# Altium project Board_C24.PrjPcb
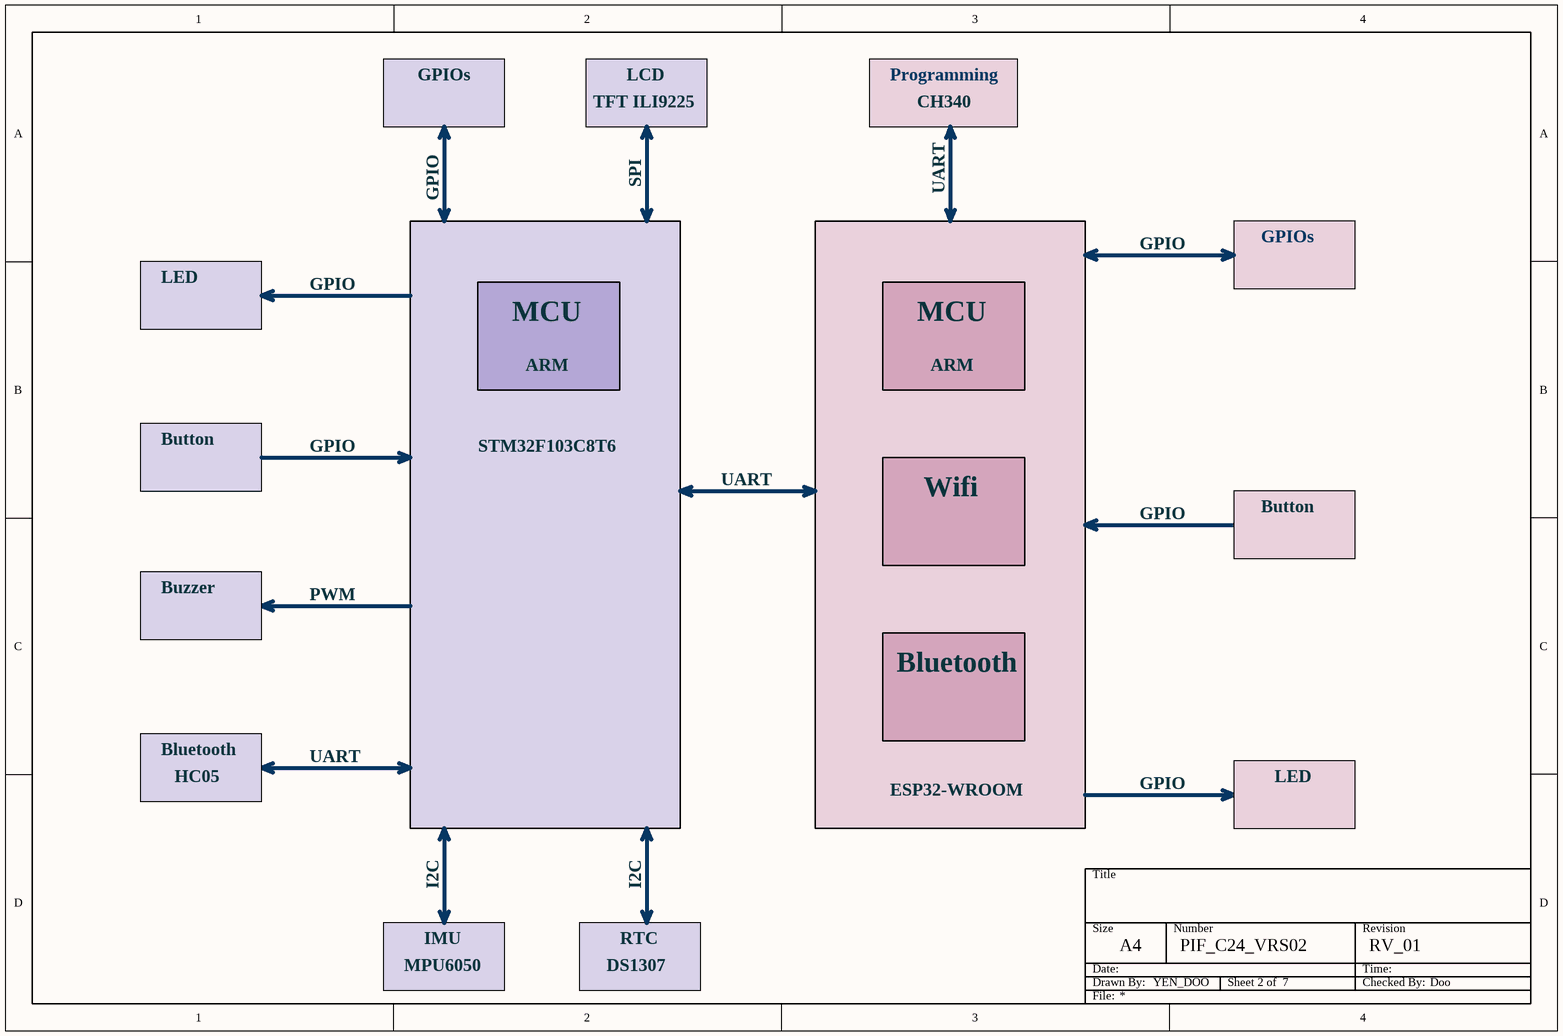
[diagram p0: 01_Block_Diagram.SchDoc]
5 sheets, 74 parts. Net scope: flat (ports and power ports of the same name join across sheets).
Board files: Board_C24_vrs0.PcbDoc, Board_C24_vrs02.PcbDoc, Board_C24_vrs03.PcbDoc, Board_C24_vrs01.PcbDoc
Sheets:
  01_Block_Diagram.SchDoc
  02_Power_Diagram.SchDoc
  03_MCU.SchDoc
  05_ESP32.SchDoc
  06_Power_Supply.SchDoc

## Sheet 01_Block_Diagram.SchDoc
size A4; CheckedBy: Doo; Author: Doo; DocumentNumber: PIF_C24_VRS02; Revision: RV_01; SheetNumber: 2; SheetTotal: 7

### Notes on the sheet
- GPIOs
- TFT ILI9225
- LCD
- Programming
- CH340
- GPIO
- SPI
- UART
- LED
- MCU
- ARM
- Button
- STM32F103C8T6
- Wifi
- Buzzer
- PWM
- Bluetooth
- HC05
- ESP32-WROOM
- I2C
- MPU6050
- IMU
- DS1307
- RTC
- Title
- Size
- Date:
- Drawn By:
- A4
- YEN_DOO
- Number
- Revision
- Checked By:
- Time:
- File:

## Sheet 02_Power_Diagram.SchDoc
size A4; CheckedBy: Doo; Author: Doo; DrawnBy: Doo; DocumentNumber: PIF_C24_VRS02; Revision: RV_01; SheetNumber: 3; SheetTotal: 7
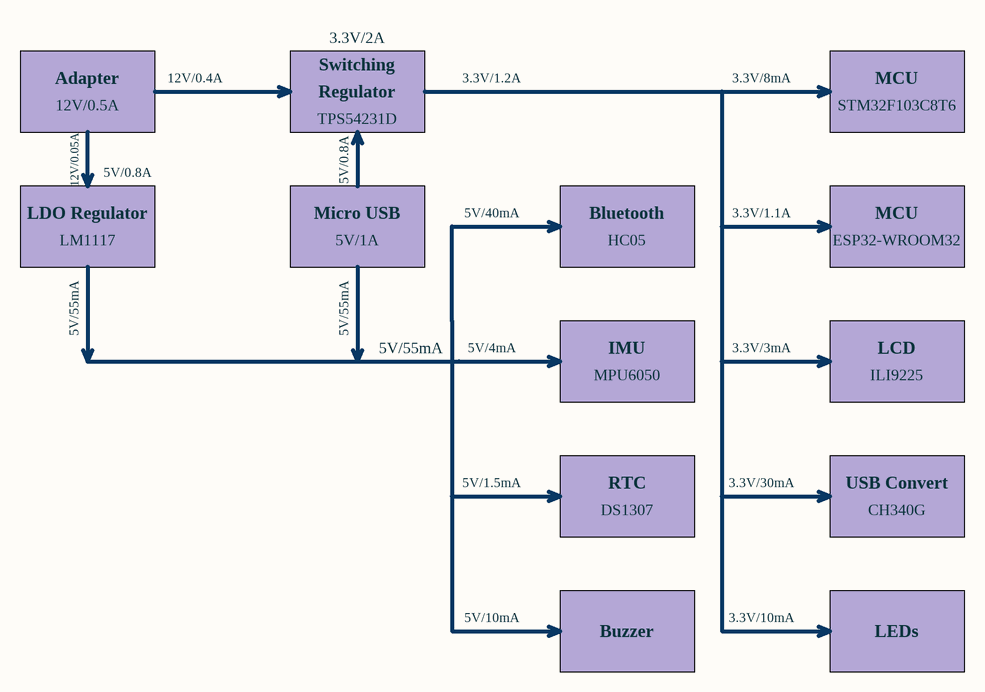
[diagram p1: 02_Power_Diagram.SchDoc]

### Notes on the sheet
- Adapter
- 12V/0.4A
- Switching
- Regulator
- 3.3V/2A
- 3.3V/1.2A
- 3.3V/8mA
- MCU
- 12V/0.05A
- 12V/0.5A
- 5V/0.8A
- TPS54231D
- STM32F103C8T6
- LDO Regulator
- Micro USB
- 5V/40mA
- Bluetooth
- 3.3V/1.1A
- LM1117
- 5V/1A
- HC05
- ESP32-WROOM32
- 5V/55mA
- 5V/4mA
- IMU
- 3.3V/3mA
- LCD
- MPU6050
- ILI9225
- 5V/1.5mA
- RTC
- 3.3V/30mA
- USB Convert
- DS1307
- CH340G
- 5V/10mA
- Buzzer
- 3.3V/10mA
- LEDs
- Title
- Size
- Date:
- Drawn By:
- A4
- YEN_DOO
- Number
- Revision
- Checked By:
- Time:
- File:

## Sheet 03_MCU.SchDoc
size A4; ApprovedBy: Doo; CheckedBy: Doo; DocumentNumber: PIF_C24_VRS02; Revision: RV_01; SheetNumber: 3; SheetTotal: 5
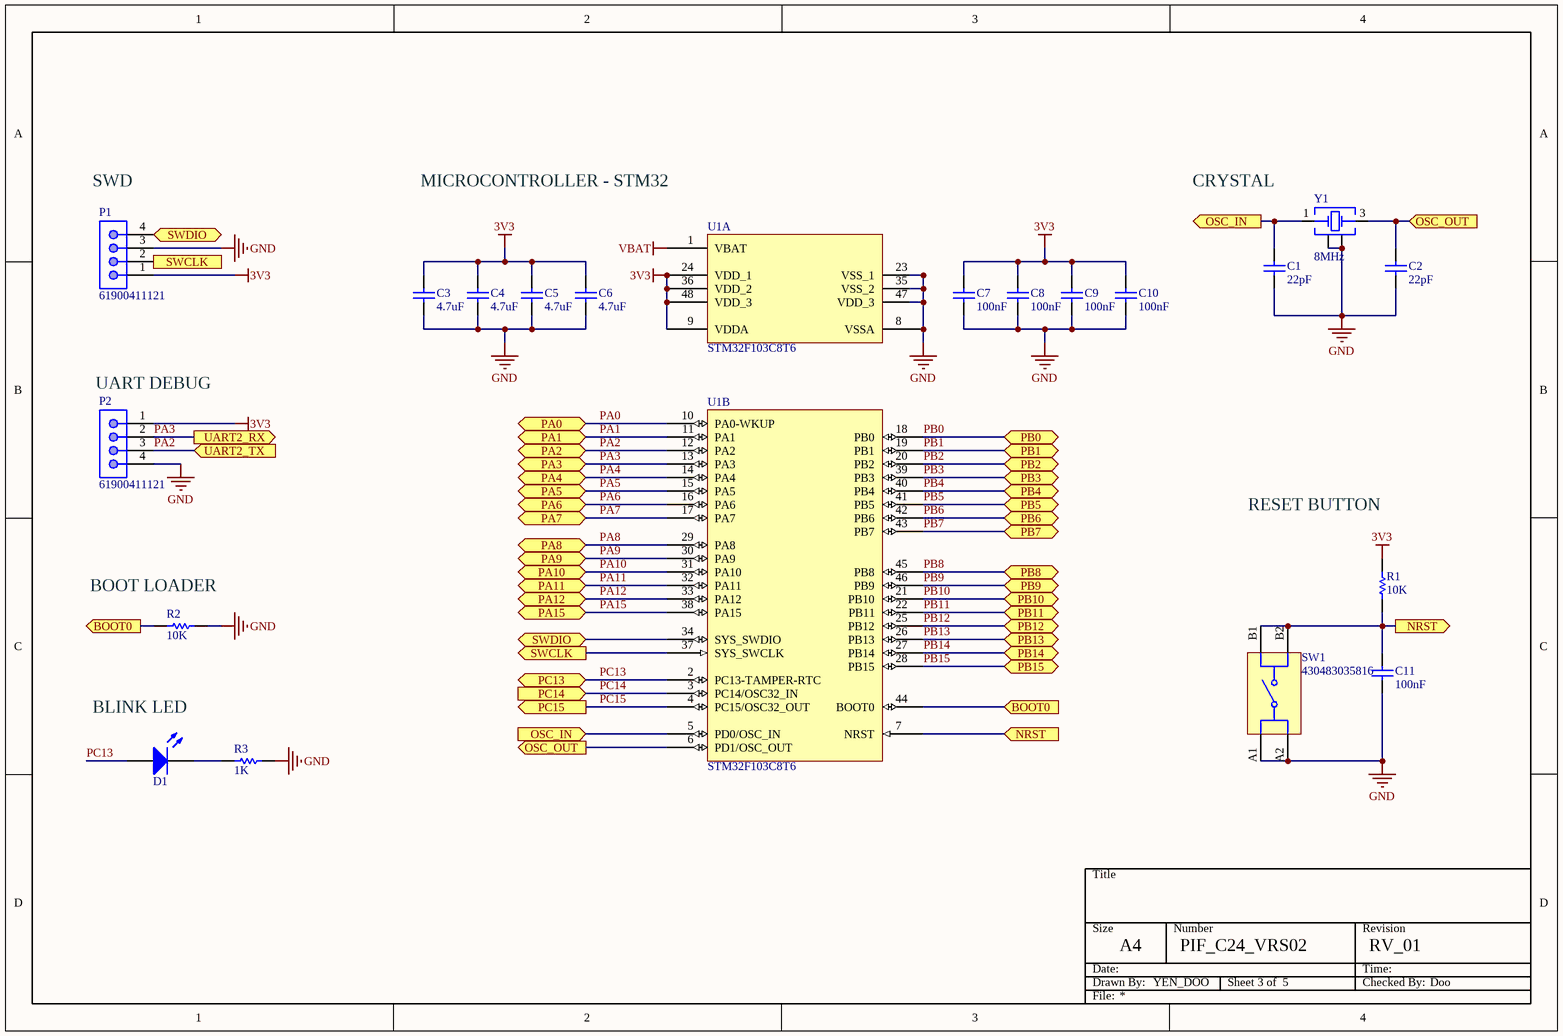
[diagram p2: 03_MCU.SchDoc]

### Parts
C1  value 22pF  [CAP-SM-0805]  (hidden comment: Cap Non-Pol SMD)
C2  value 22pF  [CAP-SM-0805]  (hidden comment: Cap Non-Pol SMD)
C3  value 4.7uF  [CAP-SM-0805]  (hidden comment: Cap Non-Pol SMD)
C4  value 4.7uF  [CAP-SM-0805]  (hidden comment: Cap Non-Pol SMD)
C5  value 4.7uF  [CAP-SM-0805]  (hidden comment: Cap Non-Pol SMD)
C6  value 4.7uF  [CAP-SM-0805]  (hidden comment: Cap Non-Pol SMD)
C7  value 100nF  [CAP-SM-0805]  (hidden comment: Cap Non-Pol SMD)
C8  value 100nF  [CAP-SM-0805]  (hidden comment: Cap Non-Pol SMD)
C9  value 100nF  [CAP-SM-0805]  (hidden comment: Cap Non-Pol SMD)
C10  value 100nF  [CAP-SM-0805]  (hidden comment: Cap Non-Pol SMD)
C11  value 100nF  [CAP-SM-0805]  (hidden comment: Cap Non-Pol SMD)
D1  LED SMD  [LED_0805_Blue]  (value not drawn)
P1  61900411121  [61900411121]
P2  61900411121  [61900411121]
R1  value 10K  [RES-SM-0805]  (hidden comment: RESISTOR SMD)
R2  value 10K  [RES-SM-0805]  (hidden comment: RESISTOR SMD)
R3  value 1K  [RES-SM-0805]  (hidden comment: RESISTOR SMD)
SW1  430483035816  [WS-TASV_L6W6H3.5_4304x30358x6]
U1  STM32F103C8T6  [LQFP48]  (parts A,B of 2)
Y1  8MHz  [WE-XTAL_CFPX-104]

### Ports
BOOT0 (in), BOOT0 (out), NRST (in), NRST (out), OSC_IN (in), OSC_IN (out), OSC_OUT (in), OSC_OUT (out), PA0 (bidir), PA1 (bidir), PA2 (bidir), PA3 (bidir), PA4 (bidir), PA5 (bidir), PA6 (bidir), PA7 (bidir), PA8 (bidir), PA9 (bidir), PA10 (bidir), PA11 (bidir), PA12 (bidir), PA15 (bidir), PB0 (bidir), PB1 (bidir), PB2 (bidir), PB3 (bidir), PB4 (bidir), PB5 (bidir), PB6 (bidir), PB7 (bidir), PB8 (bidir), PB9 (bidir), PB10 (bidir), PB11 (bidir), PB12 (bidir), PB13 (bidir), PB14 (bidir), PB15 (bidir), PC13 (bidir), PC14 (in), PC15 (out), SWCLK (in), SWCLK (out), SWDIO (bidir), UART2_RX (out), UART2_TX (in)

### Nets
3V3: C3.2 C4.2 C5.2 C6.2 C7.2 C8.2 C9.2 C10.2 P1.1 P2.1 R1.2 U1.9(VDDA) U1.24(VDD_1) U1.36(VDD_2) U1.48(VDD_3)
GND: C1.1 C2.1 C3.1 C4.1 C5.1 C6.1 C7.1 C8.1 C9.1 C10.1 C11.1 P1.3 P2.4 R2.1 R3.1 SW1.A1 SW1.A2 U1.8(VSSA) U1.23(VSS_1) U1.35(VSS_2) U1.47(VDD_3) Y1.2(GND) Y1.4(GND)
VBAT: U1.1(VBAT)
PA0: U1.10(PA0-WKUP) ; port PA0
PA1: U1.11(PA1) ; port PA1
PA2: P2.3 U1.12(PA2) ; port PA2, port UART2_TX
PA3: P2.2 U1.13(PA3) ; port PA3, port UART2_RX
PA4: U1.14(PA4) ; port PA4
PA5: U1.15(PA5) ; port PA5
PA6: U1.16(PA6) ; port PA6
PA7: U1.17(PA7) ; port PA7
PA8: U1.29(PA8) ; port PA8
PA9: U1.30(PA9) ; port PA9
PA10: U1.31(PA10) ; port PA10
PA11: U1.32(PA11) ; port PA11
PA12: U1.33(PA12) ; port PA12
PA15: U1.38(PA15) ; port PA15
PB0: U1.18(PB0) ; port PB0
PB1: U1.19(PB1) ; port PB1
PB2: U1.20(PB2) ; port PB2
PB3: U1.39(PB3) ; port PB3
PB4: U1.40(PB4) ; port PB4
PB5: U1.41(PB5) ; port PB5
PB6: U1.42(PB6) ; port PB6
PB7: U1.43(PB7) ; port PB7
PB8: U1.45(PB8) ; port PB8
PB9: U1.46(PB9) ; port PB9
PB10: U1.21(PB10) ; port PB10
PB11: U1.22(PB11) ; port PB11
PB12: U1.25(PB12) ; port PB12
PB13: U1.26(PB13) ; port PB13
PB14: U1.27(PB14) ; port PB14
PB15: U1.28(PB15) ; port PB15
PC13: D1.1(A) U1.2(PC13-TAMPER-RTC) ; port PC13
PC14: U1.3(PC14/OSC32_IN) ; port PC14
PC15: U1.4(PC15/OSC32_OUT) ; port PC15
NetC1_2: C1.2 U1.5(PD0/OSC_IN) Y1.1(OSC1) ; port OSC_IN
NetC2_2: C2.2 U1.6(PD1/OSC_OUT) Y1.3(OSC2) ; port OSC_OUT
NetC11_2: C11.2 R1.1 SW1.B1 SW1.B2 U1.7(NRST) ; port NRST
NetD1_2: D1.2(K) R3.2
NetP1_2: P1.2 U1.37(SYS_SWCLK) ; port SWCLK
NetP1_4: P1.4 U1.34(SYS_SWDIO) ; port SWDIO
NetR2_2: R2.2 U1.44(BOOT0) ; port BOOT0

### Notes on the sheet
- (near P1) SWD
- MICROCONTROLLER - STM32
- CRYSTAL
- (near P2) UART DEBUG
- RESET BUTTON
- (near R2) BOOT LOADER
- BLINK LED
- Title
- Size
- Date:
- Drawn By:
- A4
- YEN_DOO
- Number
- Revision
- Checked By:
- Time:
- File:

### Library data of the parts
C1-C11 = Cap Non-Pol SMD: Capacitor
D1 = LED SMD: LED
P1 P2 = 61900411121: WR-WTB THT Male Vertical Locking Header, pitch 2.54mm, 4p; Pin Number: 4; Contact Resistance: 20mOhm; Rated Current: 3A; Withstanding Voltage: 1000VAC; Working Voltage: 250VAC; ComponentLink1Description: Manufacturer; ComponentLink1URL: http://www.we-online.de; ComponentLink2Description: Datasheet; ComponentLink2URL: https://www.we-online.com/catalog/datasheet/61900411121.pdf; Pitch: 2.54mm; Published Date: January 2020; Publisher: Wurth Elektronik; Mounting Technology: THT; Packaging: Bag; Operating Temperature: -40 to +105degC; Part Number: 61900411121; Gender: Male; Type: Vertical
R1-R3 = RESISTOR SMD: Resistor
SW1 = 430483035816: WS-TASV J-Bend SMT Washable Tact Switch, 12VDC, 50mA, 160g, height 3.5mm; Manufacturer: Wurth Elektronik; Rated Voltage: 12V; Washable: Yes; Actuator Color: Black; Electrical Life: 1000000Cycles; ComponentLink1Description: Manufacturer Link; ComponentLink1URL: http://www.we-online.de; ComponentLink2Description: Datasheet; ComponentLink2URL: https://www.we-online.com/catalog/datasheet/430483035816.pdf; Manufacturer Part Number: 430483035816; Contact Material: Stainless Steel; Mounting Technology: SMT; Contact Plating: Silver; Operation Force: 160g; Packaging: Tape and Reel; Terminal Material: Copper Alloy; Rated Current: 50mA; Terminal Plating: Silver; Height: 3.5mm; Length: 6mm; Operating Temperature max.: 85C; Operating Temperature min.: -40C; Width: 6mm
U1 = STM32F103C8T6: ARM Microcontrollers - MCU 32BIT Cortex M3 64KB 20KB RAM 2X12 ADC; Manufacturer: STMicroelectronics; Core: ARM Cortex M3; ADC Resolution: 12 bit; Maximum Clock Frequency: 72 MHz; Number of I/Os: 37 I/O; Supply Voltage - Min: 2 V; Supply Voltage - Max: 3.6 V; Interface Type: CAN, I2C, SPI, USART, USB; Data RAM Type: SRAM; Number of ADC Channels: 10 Channel; Number of Timers/Counters: 3 Timer; Processor Series: ARM Cortex M; Product Category: ARM Microcontrollers - MCU; Series: STM32F103C8; Mounting Style: SMD/SMT; Package / Case: LQFP-48; Program Memory Size: 64 kB; Data Bus Width: 32 bit; Data RAM Size: 20 kB; Minimum Operating Temperature: - 40 C; Maximum Operating Temperature: + 85 C; Length: 7 mm; ComponentLink1Description: Datasheet; ComponentLink1URL: https://www.mouser.vn/datasheet/2/389/stm32f103c8-1851025.pdf
Y1 = 830106162701: WE-XTAL Quartz Crystal, SMT, CFPX-104, 8MHz, +/-20ppm; Manufacturer: Wurth Elektronik; Frequency Stability: +/-30ppm; Load Capacitance: 16pF; ComponentLink1Description: Manufacturer; ComponentLink1URL: http://www.we-online.de; ComponentLink2Description: Datasheet; ComponentLink2URL: https://www.we-online.com/catalog/datasheet/830106162701.pdf; Operating Temperature: -40 to +85degC; Packaging: Tape and Reel; Manufacturer Part Number: 830106162701; Published Date: November 2020; Size: CFPX-104; Frequency: 8MHz; Frequency Tolerance: +/-20ppm; Mounting Technology: SMT

## Sheet 05_ESP32.SchDoc
size A4; CheckedBy: Doo; Author: Doo; DocumentNumber: PIF_C24_VRS02; Revision: RV_01; SheetNumber: 6; SheetTotal: 7
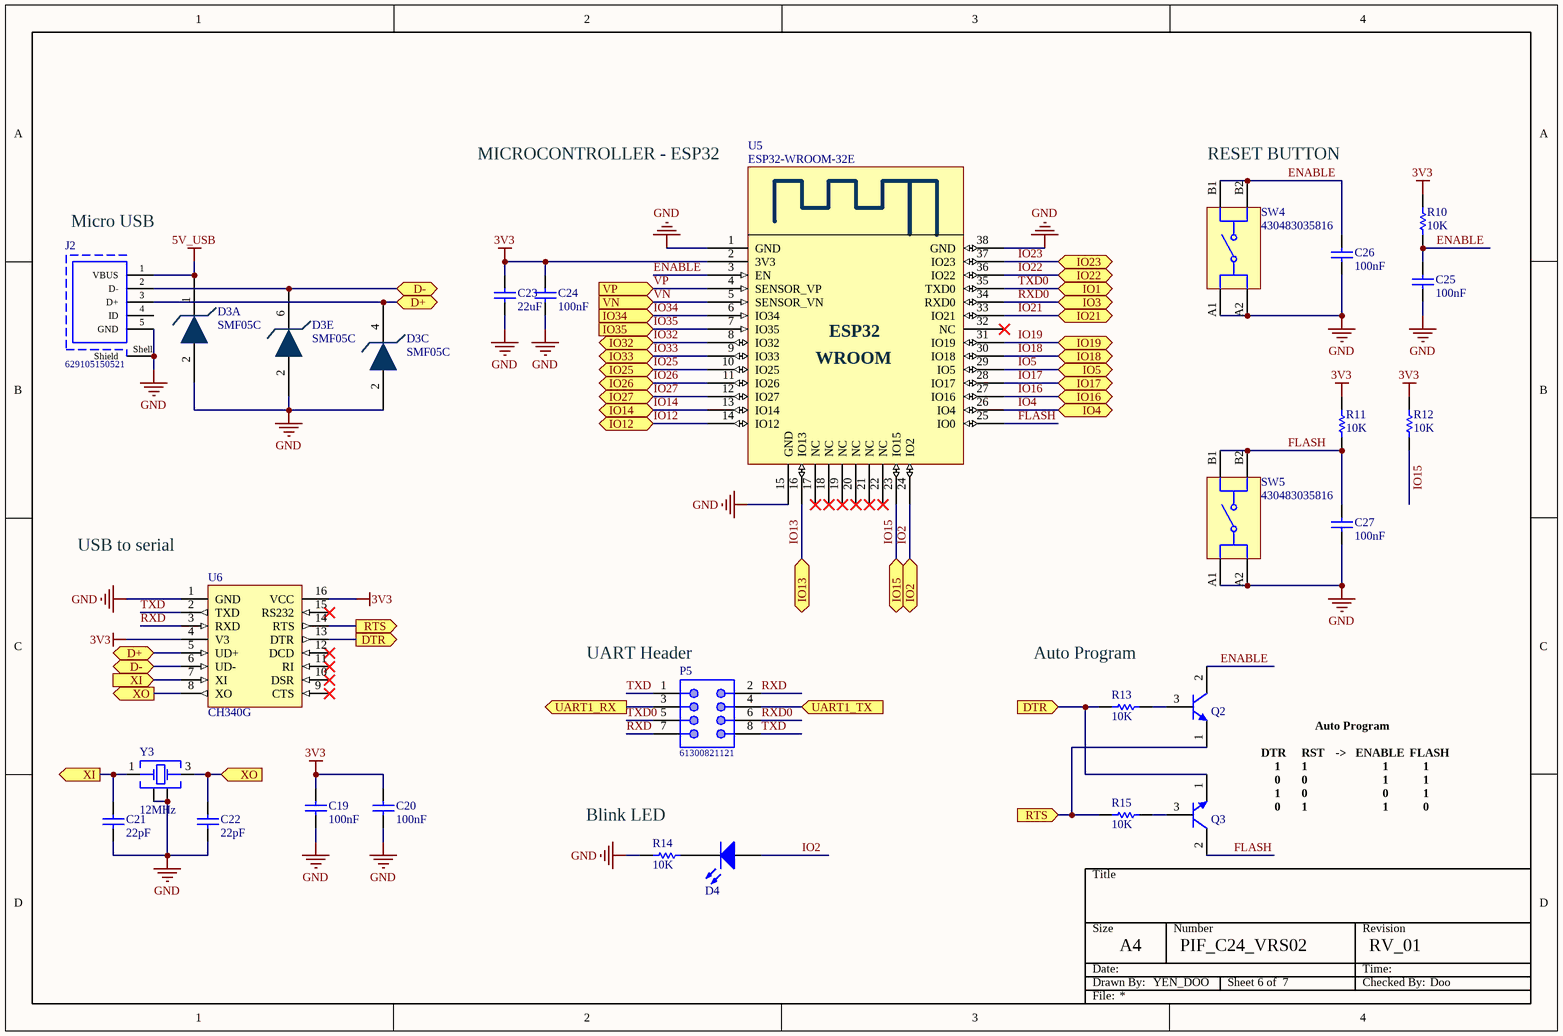
[diagram p3: 05_ESP32.SchDoc]

### Parts
C19  value 100nF  [CAP-SM-0805]  (hidden comment: Cap Non-Pol SMD)
C20  value 100nF  [CAP-SM-0805]  (hidden comment: Cap Non-Pol SMD)
C21  value 22pF  [CAP-SM-0805]  (hidden comment: Cap Non-Pol SMD)
C22  value 22pF  [CAP-SM-0805]  (hidden comment: Cap Non-Pol SMD)
C23  value 22uF  [CAP-SM-0805]  (hidden comment: Cap Non-Pol SMD)
C24  value 100nF  [CAP-SM-0805]  (hidden comment: Cap Non-Pol SMD)
C25  value 100nF  [CAP-SM-0805]  (hidden comment: Cap Non-Pol SMD)
C26  value 100nF  [CAP-SM-0805]  (hidden comment: Cap Non-Pol SMD)
C27  value 100nF  [CAP-SM-0805]  (hidden comment: Cap Non-Pol SMD)
D3  SMF05C  [SC70 6L]  (parts A,C,E of 5)
D4  LED SMD  [LED_0805_Blue]  (value not drawn)
J2  629105150521  [629105150521]
P5  61300821121  [61300821121]
Q2  C1815  [SOT23B]  (value not drawn)
Q3  C1815  [SOT23B]  (value not drawn)
R10  value 10K  [RES-SM-0805]  (hidden comment: RESISTOR SMD)
R11  value 10K  [RES-SM-0805]  (hidden comment: RESISTOR SMD)
R12  value 10K  [RES-SM-0805]  (hidden comment: RESISTOR SMD)
R13  value 10K  [RES-SM-0805]  (hidden comment: RESISTOR SMD)
R14  value 10K  [RES-SM-0805]  (hidden comment: RESISTOR SMD)
R15  value 10K  [RES-SM-0805]  (hidden comment: RESISTOR SMD)
SW4  430483035816  [WS-TASV_L6W6H3.5_4304x30358x6]
SW5  430483035816  [WS-TASV_L6W6H3.5_4304x30358x6]
U5  ESP32-WROOM-32E  [ESP32-WROOM]
U6  CH340G  [DSIP-16]
Y3  12MHz  [WE-XTAL_CFPX-104]

### Ports
D+ (bidir), D- (bidir), DTR (in), DTR (out), IO1 (bidir), IO2 (bidir), IO3 (bidir), IO4 (bidir), IO5 (bidir), IO12 (bidir), IO13 (bidir), IO14 (bidir), IO15 (bidir), IO16 (bidir), IO17 (bidir), IO18 (bidir), IO19 (bidir), IO21 (bidir), IO22 (bidir), IO23 (bidir), IO25 (bidir), IO26 (bidir), IO27 (bidir), IO32 (bidir), IO33 (bidir), IO34 (in), IO35 (in), RTS (in), RTS (out), UART1_RX (out), UART1_TX (in), VN (in), VP (in), XI (in), XI (out), XO (in), XO (out)

### Nets
3V3: C19.2 C20.2 C23.2 C24.2 R10.2 R11.2 R12.2 U5.2(3V3) U6.4(V3) U6.16(VCC)
5V_USB: D3.1 J2.1(VBUS)
GND: C19.1 C20.1 C21.1 C22.1 C23.1 C24.1 C25.1 C26.1 C27.1 D3.2(COM) J2.5(GND) J2.Shell(Shield) R14.1 SW4.A1 SW4.A2 SW5.A1 SW5.A2 U5.1(GND) U5.15(GND) U5.38(GND) U6.1(GND) Y3.2(GND_&_Lid) Y3.4(GND_&_Lid)
ENABLE: C25.2 C26.2 Q2.2(C) R10.1 SW4.B1 SW4.B2 U5.3(EN)
FLASH: C27.2 Q3.2(C) R11.1 SW5.B1 SW5.B2 U5.25(IO0)
IO2: D4.1(A) U5.24(IO2) ; port IO2
IO4: U5.26(IO4) ; port IO4
IO5: U5.29(IO5) ; port IO5
IO12: U5.14(IO12) ; port IO12
IO13: U5.16(IO13) ; port IO13
IO14: U5.13(IO14) ; port IO14
IO15: R12.1 U5.23(IO15) ; port IO15
IO16: U5.27(IO16) ; port IO16
IO17: U5.28(IO17) ; port IO17
IO18: U5.30(IO18) ; port IO18
IO19: U5.31(IO19) ; port IO19
IO21: U5.33(IO21) ; port IO21
IO22: U5.36(IO22) ; port IO22
IO23: U5.37(IO23) ; port IO23
IO25: U5.10(IO25) ; port IO25
IO26: U5.11(IO26) ; port IO26
IO27: U5.12(IO27) ; port IO27
IO32: U5.8(IO32) ; port IO32
IO33: U5.9(IO33) ; port IO33
IO34: U5.6(IO34) ; port IO34
IO35: U5.7(IO35) ; port IO35
RXD: P5.2 P5.7 U6.3(RXD)
RXD0: P5.6 U5.34(RXD0) ; port IO3
TXD: P5.1 P5.8 U6.2(TXD)
TXD0: P5.5 U5.35(TXD0) ; port IO1
VN: U5.5(SENSOR_VN) ; port VN
VP: U5.4(SENSOR_VP) ; port VP
NetC21_2: C21.2 U6.7(XI) Y3.1(Crystal) ; port XI
NetC22_2: C22.2 U6.8(XO) Y3.3(Crystal) ; port XO
NetD3_4: D3.4 J2.3(D+) U6.5(UD+) ; port D+
NetD3_6: D3.6 J2.2(D-) U6.6(UD-) ; port D-
NetD4_2: D4.2(K) R14.2
NetP5_3: P5.3 ; port UART1_RX
NetP5_4: P5.4 ; port UART1_TX
NetQ2_1: Q2.1(E) R15.2 U6.14(RTS) ; port RTS
NetQ2_3: Q2.3(B) R13.1
NetQ3_1: Q3.1(E) R13.2 U6.13(DTR) ; port DTR
NetQ3_3: Q3.3(B) R15.1

Not connected (* = marked no-connect by the designer): J2 4(ID); U5 17(NC)* 18(NC)* 19(NC)* 20(NC)* 21(NC)* 22(NC)* 32(NC)*; U6 9(CTS)* 10(DSR)* 11(RI)* 12(DCD)* 15(RS232)*

### Notes on the sheet
- MICROCONTROLLER - ESP32
- (near SW4) RESET BUTTON
- (near J2) Micro USB
- (near U6) USB to serial
- (near P5) UART Header
- Auto Program
- DTR
- 1
- 0
- RST
- ->
- ENABLE
- FLASH
- (near R14) Blink LED
- Title
- Size
- Date:
- Drawn By:
- A4
- YEN_DOO
- Number
- Revision
- Checked By:
- Time:
- File:
- (in symbol ESP32-WROOM) WROOM

### Library data of the parts
C19-C27 = Cap Non-Pol SMD: Capacitor
D3 = SMF05: 12.5V Clamp 8A (8/20µs) Ipp Tvs Diode Surface Mount SC-70-6; Mfr: Semtech Corporation; Type: Zener; Unidirectional Channels: 5; Voltage - Reverse Standoff (Typ): 5V (Max); Voltage - Breakdown (Min): 6V; Power - Peak Pulse: 100W; Capacitance @ Frequency: 130pF @ 1MHz; Category: Circuit Protection; Voltage - Clamping (Max) @ Ipp: 12.5V; Current - Peak Pulse (10/1000µs): 8A (8/20µs); Operating Temperature: -55°C ~ 125°C (TJ); ComponentLink1Description: Datasheet; ComponentLink1URL: https://datasheet.lcsc.com/lcsc/1809291621_SEMTECH-SMF05C-TCT_C85191.pdf*; ComponentLink2Description: Thegioiic; ComponentLink2URL: https://www.thegioiic.com/smf05c-tct
D4 = LED SMD: LED
J2 = 629105150521: Micro USB 2.0 Type B Receptacle WR-COM, Horizontal, SMT, with Pegs, High Current at Pin 1 & Pin 5; Rated Current: 3 A; Contact Resistance: 30 mOhm; Working Voltage: 30 VAC; ComponentLink1Description: Manufacturer; ComponentLink1URL: http://www.we-online.de; ComponentLink2Description: Datasheet; ComponentLink2URL: https://katalog.we-online.de/em/datasheet/629105150521.pdf; Part Number: 629105150521; Published Date: September 2018; Publisher: Wurth Elektronik; Orientation: Horizontal; Connector Type: Micro USB 2.0 Type B; Operating Temperature: -40 to 85 degC; Mounting Technology: SMT; Gender: Receptacle; Packaging: Tape and Reel
P5 = 61300821121: WR-PHD Pin Header, THT, pitch 2.54mm, Dual Row, Vertical, 8p; Manufacturer: Wurth Elektronik; Pin Number: 8; Rated Current: 3A; Working Voltage: 250VAC; Withstanding Voltage: 500VAC; Contact Resistance: 20mOhm; ComponentLink1Description: Manufacturer; ComponentLink1URL: http://www.we-online.de; ComponentLink2Description: Datasheet; ComponentLink2URL: https://www.we-online.com/catalog/datasheet/61300821121.pdf; Manufacturer Part Number: 61300821121; Published Date: May 2020; Pitch: 2.54mm; Operating Temperature: -40 to +105degC; Mounting Technology: THT; Packaging: Bag; Gender: Pin Header; Row Number: Dual; Orientation: Vertical
Q2 Q3 = C1815: NPN Bipolar Transistor
R10-R15 = RESISTOR SMD: Resistor
SW4 SW5 = 430483035816: as SW1 on sheet 03_MCU; ComponentLink1Description: Manufacturer Link; ComponentLink1URL: http://www.we-online.de; ComponentLink2Description: Datasheet; ComponentLink2URL: https://www.we-online.com/catalog/datasheet/430483035816.pdf; Manufacturer Part Number: 430483035816; Contact Material: Stainless Steel; Mounting Technology: SMT; Contact Plating: Silver; Operation Force: 160g; Packaging: Tape and Reel; Terminal Material: Copper Alloy; Rated Current: 50mA; Terminal Plating: Silver; Height: 3.5mm; Length: 6mm; Operating Temperature max.: 85C; Operating Temperature min.: -40C; Width: 6mm
U5 = ESP32-WROOM: Bluetooth, WiFi 802.11b/g/n, Bluetooth v4.2 +EDR, Class 1, 2 and 3 Transceiver Module 2.4GHz ~ 2.5GHz Integrated, Trace Surface Mount; Mfr: Espressif Systems; Utilized IC / Part: ESP32-D0WD-V3; Modulation: CCK, DSSS, OFDM; Data Rate: 150Mbps; Power - Output: 20dBm; Sensitivity: -98dBm; Serial Interfaces: ADC, GPIO, I²C, I²S, PWM, SDIO, SPI, UART; Memory Size: 4MB Flash, 448kB ROM, 536kB SRAM; Voltage - Supply: 3V ~ 3.6V; Category: RF and Wireless; Series: ESP32; RF Family/Standard: Bluetooth, WiFi; Protocol: 802.11b/g/n, Bluetooth v4.2 +EDR, Class 1, 2 and 3; Frequency: 2.4GHz ~ 2.5GHz; Antenna Type: Integrated, Trace; Mounting Type: Surface Mount; ComponentLink1Description: Hshop; ComponentLink1URL: https://hshop.vn/products/mach-thu-phat-wifi-ble-soc-esp32-v1; Operating Temperature: -40°C ~ 85°C; ComponentLink2Description: Datasheet; ComponentLink2URL: https://www.espressif.com/sites/default/files/russianDocumentation/esp32-wroom-32e_esp32-wroom-32ue_datasheet_en.pdf
U6 = CH340: USB Bridge, USB to UART USB 2.0 UART Interface; Mfr: SparkFun Electronics; Standards: USB 2.0; Voltage - Supply: 3V ~ 3.6V; Current - Supply: 20mA; Protocol: USB; Function: Bridge, USB to UART; Interface: UART; Operating Temperature: -20°C ~ 70°C (TA); ComponentLink1Description: Thegioiic; ComponentLink1URL: https://www.thegioiic.com/ch340g; ComponentLink2Description: Datasheet; ComponentLink2URL: https://www.thegioiic.com/upload/documents/5d39d5f0043101a4c964078db79fe1bd.PDF
Y3 = 830055999: WE-XTAL Quartz Crystal, SMT, CFPX-104, 12MHz, +/-30ppm; Manufacturer: Wurth Elektronik; Load Capacitance: 18pF; ComponentLink1Description: Manufacturer; ComponentLink1URL: http://www.we-online.de; ComponentLink2Description: Datasheet; ComponentLink2URL: https://katalog.we-online.com/pbs/datasheet/830055999.pdf; Operating Temperature: -40 to +85degC; Packaging: Tape and Reel; Manufacturer Part Number: 830055999; Published Date: July 2020; Size: CFPX-104; Frequency Stability: +/-30ppm; Frequency: 12MHz; Frequency Tolerance: +/-30ppm; Mounting Technology: SMT

## Sheet 06_Power_Supply.SchDoc
size A4; CheckedBy: Doo; Author: Doo; DocumentNumber: PIF_C24_VRS02; Revision: RV_01; SheetNumber: 5; SheetTotal: 5
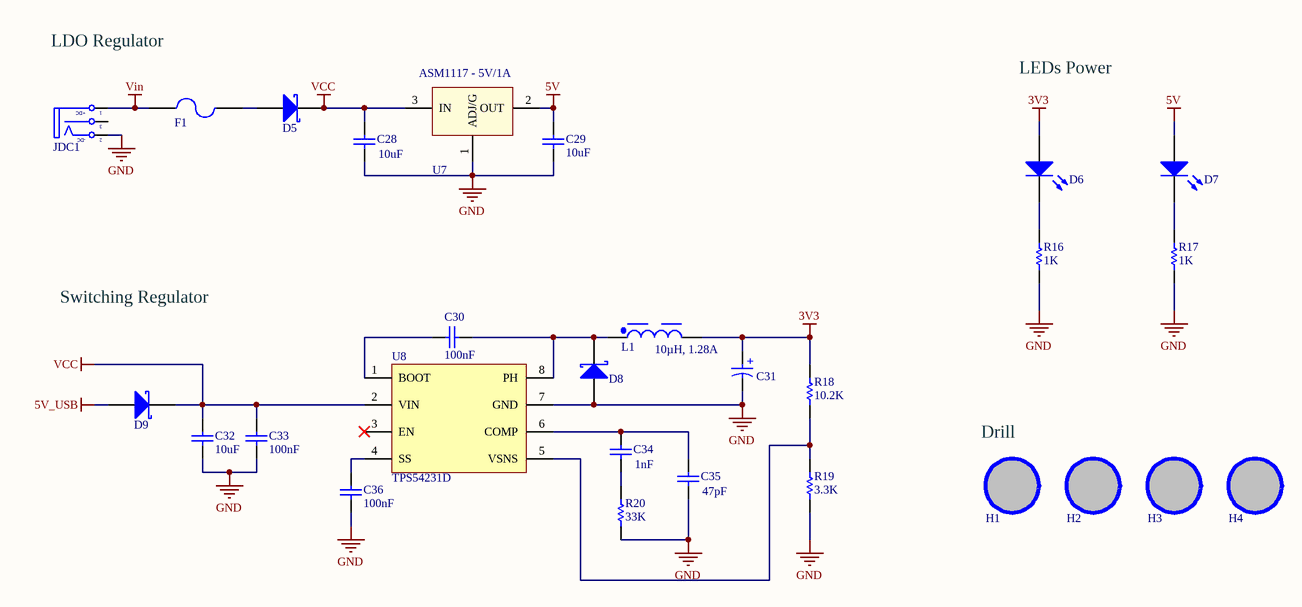
[diagram p4: 06_Power_Supply.SchDoc]

### Parts
C28  value 10uF  [CAP-SM-0805]  (hidden comment: Cap Non-Pol SMD)
C29  value 10uF  [CAP-SM-0805]  (hidden comment: Cap Non-Pol SMD)
C30  value 100nF  [CAP-SM-0805]  (hidden comment: Cap Non-Pol SMD)
C31  100uF  [WCAP-ASLI_D6.3H5.5]  (value not drawn)
C32  value 10uF  [CAP-SM-0805]  (hidden comment: Cap Non-Pol SMD)
C33  value 100nF  [CAP-SM-0805]  (hidden comment: Cap Non-Pol SMD)
C34  value 1nF  [CAP-SM-0805]  (hidden comment: Cap Non-Pol SMD)
C35  value 47pF  [CAP-SM-0805]  (hidden comment: Cap Non-Pol SMD)
C36  value 100nF  [CAP-SM-0805]  (hidden comment: Cap Non-Pol SMD)
D5  D Schottky  [SS34]  (value not drawn)
D6  LED SMD  [LED_0805_Blue]  (value not drawn)
D7  LED SMD  [LED_0805_Blue]  (value not drawn)
D8  D Schottky  [SS34]  (value not drawn)
D9  D Schottky  [SS34]  (value not drawn)
F1  Fuse  [FUSE SMD]  (value not drawn)
H1  Hole  [LO KHOAN 3MM]  (value not drawn)
H2  Hole  [LO KHOAN 3MM]  (value not drawn)
H3  Hole  [LO KHOAN 3MM]  (value not drawn)
H4  Hole  [LO KHOAN 3MM]  (value not drawn)
JDC1  Jack DC  [DC-IN]  (value not drawn)
L1  10µH, 1.28A  [WE-PD2_3521]
R16  value 1K  [RES-SM-0805]  (hidden comment: RESISTOR SMD)
R17  value 1K  [RES-SM-0805]  (hidden comment: RESISTOR SMD)
R18  value 10.2K  [RES-SM-0805]  (hidden comment: RESISTOR SMD)
R19  value 3.3K  [RES-SM-0805]  (hidden comment: RESISTOR SMD)
R20  value 33K  [RES-SM-0805]  (hidden comment: RESISTOR SMD)
U7  ASM1117 - 5V/1A  [SOT223-4N]
U8  TPS54231D  [SOIC8]

### Nets
3V3: C31.1(P) D6.1(A) L1.2 R18.2
5V: C29.2 D7.1(A) U7.2(OUT)
5V_USB: D9.1(A)
GND: C28.1 C29.1 C31.2(N) C32.1 C33.1 C35.1 C36.1 D8.1(A) JDC1.2(TN) R16.1 R17.1 R19.1 R20.1 U7.1(ADJ/G) U8.7(GND)
VCC: C28.2 C32.2 C33.2 D5.2(K) D9.2(K) U7.3(IN) U8.2(VIN)
Vin: F1.1 JDC1.1(T)
NetC30_1: C30.1 D8.2(K) L1.1 U8.8(PH)
NetC30_2: C30.2 U8.1(BOOT)
NetC34_1: C34.1 R20.2
NetC34_2: C34.2 C35.2 U8.6(COMP)
NetC36_2: C36.2 U8.4(SS)
NetD5_1: D5.1(A) F1.2
NetD6_2: D6.2(K) R16.2
NetD7_2: D7.2(K) R17.2
NetR18_1: R18.1 R19.2 U8.5(VSNS)

Not connected (* = marked no-connect by the designer): H1 1; H2 1; H3 1; H4 1; JDC1 3(S); U8 3(EN)*

### Notes on the sheet
- LDO Regulator
- LEDs Power
- Switching Regulator
- (near H1) Drill
- Title
- Size
- Date:
- Drawn By:
- A4
- YEN_DOO
- Number
- Revision
- Checked By:
- Time:
- File:
- (in symbol 865080243007) +
- (in symbol Jack DC) +DC; -DC

### Library data of the parts
C28-C30 C32-C36 = Cap Non-Pol SMD: Capacitor
C31 = 865080243007: WCAP-ASLI Aluminum Electrolytic Capacitor, V-Chip, D6.3 x H5.5mm, 100uF, 10V; Manufacturer: Wurth Elektronik; Capacitance Tolerance: +/-20%; Dissipation Factor: 19%; Endurance: 2000h; Leakage Current: 10uA; Ripple Current: 240mA; Technical Reference: ASED055101M010DVCTBB000; Manufacturer Part Number: 865080243007; Category: Aluminum Electrolytic Capacitors; Match Code: WCAP-ASLI; ComponentLink1Description: Website Link; ComponentLink1URL: https://www.we-online.com/redexpert/article/865080243007?ad; ComponentLink2Description: Datasheet Link; ComponentLink2URL: https://www.we-online.com/redexpert/spec/865080243007?ad; Mount: Surface Mount; Operating Temperature Max: 105°C; Operating Temperature Min: -55°C; Packaging: Tape and Reel; Height: 5.5mm; Diameter: 6.3mm; Capacitance: 100uF; Rated Voltage (DC): 10V
D5 D8 D9 = D Schottky: Schottky Diode; Published: 8-Jun-2000; LatestRevisionDate: 17-Jul-2002; LatestRevisionNote: Re-released for DXP Platform.; PackageReference: SMB; Publisher: Altium Limited; PackageDescription: DO-214-AA/SMB; 2 C-Bend Leads; Body 5.3 x 3.6 mm, inc. leads (LxW); Code_JEDEC: DO-214-AA
D6 D7 = LED SMD: LED
H1-H4 = Hole: Hole 3mm
JDC1 = Jack DC: Jack DC input; Value: Jac DC
L1 = 7447732110: WE-PD2 SMT Power Inductor, size 3521, 10µH, 0.8A, 0.3Ω; Manufacturer: Wurth Elektronik; Case/Size Code: 3521; DC Resistance: 0.237Ω; Saturation Current: 1.23A; Self Resonant Frequency: 45MHz; Manufacturer Part Number: 7447732110; Category: Unshielded Power Inductors; Match Code: WE-PD2; ComponentLink1Description: Website Link; ComponentLink1URL: https://www.we-online.com/redexpert/article/7447732110?ad; ComponentLink2Description: Datasheet Link; ComponentLink2URL: https://www.we-online.com/redexpert/spec/7447732110?ad; Mount: Surface Mount; Operating Temperature Max: 125°C; Operating Temperature Min: -40°C; Packaging: Tape and Reel; Length: 3mm; Width: 3.5mm; Height: 2.1mm; DC Resistance Max: 0.3Ω; Inductance: 10µH; Rated Current: 0.8A
R16-R20 = RESISTOR SMD: Resistor
U7 = LM1117: Available in 1.8V, 2.5V, 2.85V, 3.3V, 5V, and  Adjustable Versions; Value: LM317
U8 = TPS54231: Buck Switching Regulator IC Positive Adjustable 0.8V 1 Output 2A 8-SOIC (0.154", 3.90mm Width); Mfr: Texas Instruments; Function: Step-Down; Number of Outputs: 1; Voltage - Input (Min): 3.5V; Voltage - Input (Max): 28V; Voltage - Output (Max): 25V; Frequency - Switching: 570kHz; Category: Integrated Circuits (ICs); Output Configuration: Positive; Topology: Buck; Output Type: Adjustable; Voltage - Output (Min/Fixed): 0.8V; Current - Output: 2A; Operating Temperature: -40°C ~ 150°C (TJ); Mounting Type: Surface Mount; ComponentLink1Description: Thegioiic; ComponentLink1URL: https://www.thegioiic.com/tps54231dr-ic-dieu-chinh-giam-ap-2a-8-soic; ComponentLink2Description: Datasheet; ComponentLink2URL: https://www.ti.com/lit/ds/symlink/tps54231.pdf

## Nets that join several sheets
3V3: 03_MCU (15 pins), 05_ESP32 (10 pins), 06_Power_Supply (C31.1 D6.1 L1.2 R18.2)
5V_USB: 05_ESP32 (D3.1 J2.1), 06_Power_Supply (D9.1)
GND: 03_MCU (23 pins), 05_ESP32 (23 pins), 06_Power_Supply (15 pins)